# Altium schematic sheet arduino_connector.SchDoc
size A
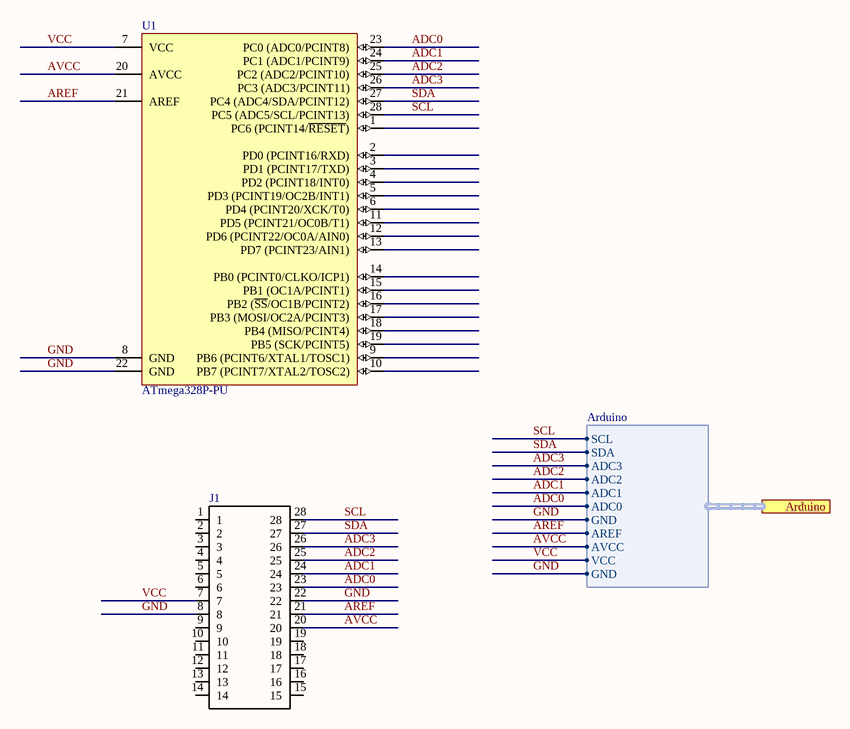
[diagram p0: arduino_connector.SchDoc]

## Parts
J1  1-2199298-9  [*DIP762W60P254L3556H510Q28]  (value not drawn)
U1  ATmega328P-PU  [28P3]

## Ports
Arduino (harness Arduino)

## Harnesses
Arduino: SCL, SDA, ADC3, ADC2, ADC1, ADC0, GND, AREF, AVCC, VCC, GND

## Nets
ADC0: J1.23 U1.23(PC0_(ADC0/PCINT8)) ; port Arduino.ADC0
ADC1: J1.24 U1.24(PC1_(ADC1/PCINT9)) ; port Arduino.ADC1
ADC2: J1.25 U1.25(PC2_(ADC2/PCINT10)) ; port Arduino.ADC2
ADC3: J1.26 U1.26(PC3_(ADC3/PCINT11)) ; port Arduino.ADC3
AREF: J1.21 U1.21(AREF) ; port Arduino.AREF
AVCC: J1.20 U1.20(AVCC) ; port Arduino.AVCC
GND: J1.8 J1.22 U1.8(GND) U1.22(GND) ; port Arduino.GND
SCL: J1.28 U1.28(PC5_(ADC5/SCL/PCINT13)) ; port Arduino.SCL
SDA: J1.27 U1.27(PC4_(ADC4/SDA/PCINT12)) ; port Arduino.SDA
VCC: J1.7 U1.7(VCC) ; port Arduino.VCC

Not connected (* = marked no-connect by the designer): J1 1 2 3 4 5 6 9 10 11 12 13 14 15 16 17 18 19; U1 1(PC6_(PCINT14/~{RESET})) 2(PD0_(PCINT16/RXD)) 3(PD1_(PCINT17/TXD)) 4(PD2_(PCINT18/INT0)) 5(PD3_(PCINT19/OC2B/INT1)) 6(PD4_(PCINT20/XCK/T0)) 9(PB6_(PCINT6/XTAL1/TOSC1)) 10(PB7_(PCINT7/XTAL2/TOSC2)) 11(PD5_(PCINT21/OC0B/T1)) 12(PD6_(PCINT22/OC0A/AIN0)) 13(PD7_(PCINT23/AIN1)) 14(PB0_(PCINT0/CLKO/ICP1)) 15(PB1_(OC1A/PCINT1)) 16(PB2_(~{SS}/OC1B/PCINT2)) 17(PB3_(MOSI/OC2A/PCINT3)) 18(PB4_(MISO/PCINT4)) 19(PB5_(SCK/PCINT5))

## Library data of the parts
J1 = 1-2199298-9: 28P,DIP SKT,300 CL,LDR,PB FREE; Product_Type: Socket; Number_of_Positions: 28; MF: TE Connectivity; Centerline_Pitch: 2.54 mm[.1 in]; TE_purchase_URL: https://www.te.com/usa-en/product-1-2199298-9.html?te_bu=Cor&te_type=disp&te_campaign=seda_glo_cor-seda-global-disp-prtnr-fy19-seda-model-bom-cta_sma-317_1&elqCampaignId=32493; EU_RoHS_Compliance: Compliant; SnapEDA_Link: https://www.snapeda.com/parts/1-2199298-9/TE%20Connectivity%20AMP%20Connectors/view-part/1265789/?ref=snap; MP: 1-2199298-9; Digi-Key_Purchase_URL: https://www.digikey.com/product-detail/en/te-connectivity-amp-connectors/1-2199298-9/A120353-ND/5022045?utm_source=snapeda&utm_medium=aggregator&utm_campaign=symbol; Digi-Key_Part_Number: A120353-ND; Package: PDIP-28 TE Connectivity; Value: *
U1 = CMP-0095-00013-2: 8-bit AVR Microcontroller, 32KB Flash, 1KB EEPROM, 2KB SRAM, 28-pin PDIP, Industrial Grade (-40°C to 85°C); RevisionNote: DatasheetVersion updated. URLs added.; PackageVersion: revB, Sep-2001; PackageDescription: 28-lead (0.300"/7.62mm Wide) Plastic Dual Inline Package (PDIP); DatasheetVersion: revD, May-2011; ComponentLink1Description: Manufacturer URL; ComponentLink1URL: http://www.atmel.com/; PackageReference: 28P3; ComponentLink2Description: ATmega48A/48PA/88A/88PA/168A/168PA/328/328P Datasheet; ComponentLink3URL: http://www.atmel.com/dyn/resources/prod_documents/8271S.pdf; ComponentLink2URL: http://www.atmel.com/dyn/resources/prod_documents/8271.pdf; ComponentLink3Description: ATmega48A/48PA/88A/88PA/168A/168PA/328/328P Summary